# EAGLE design rrcmd (EAGLE 6.4)
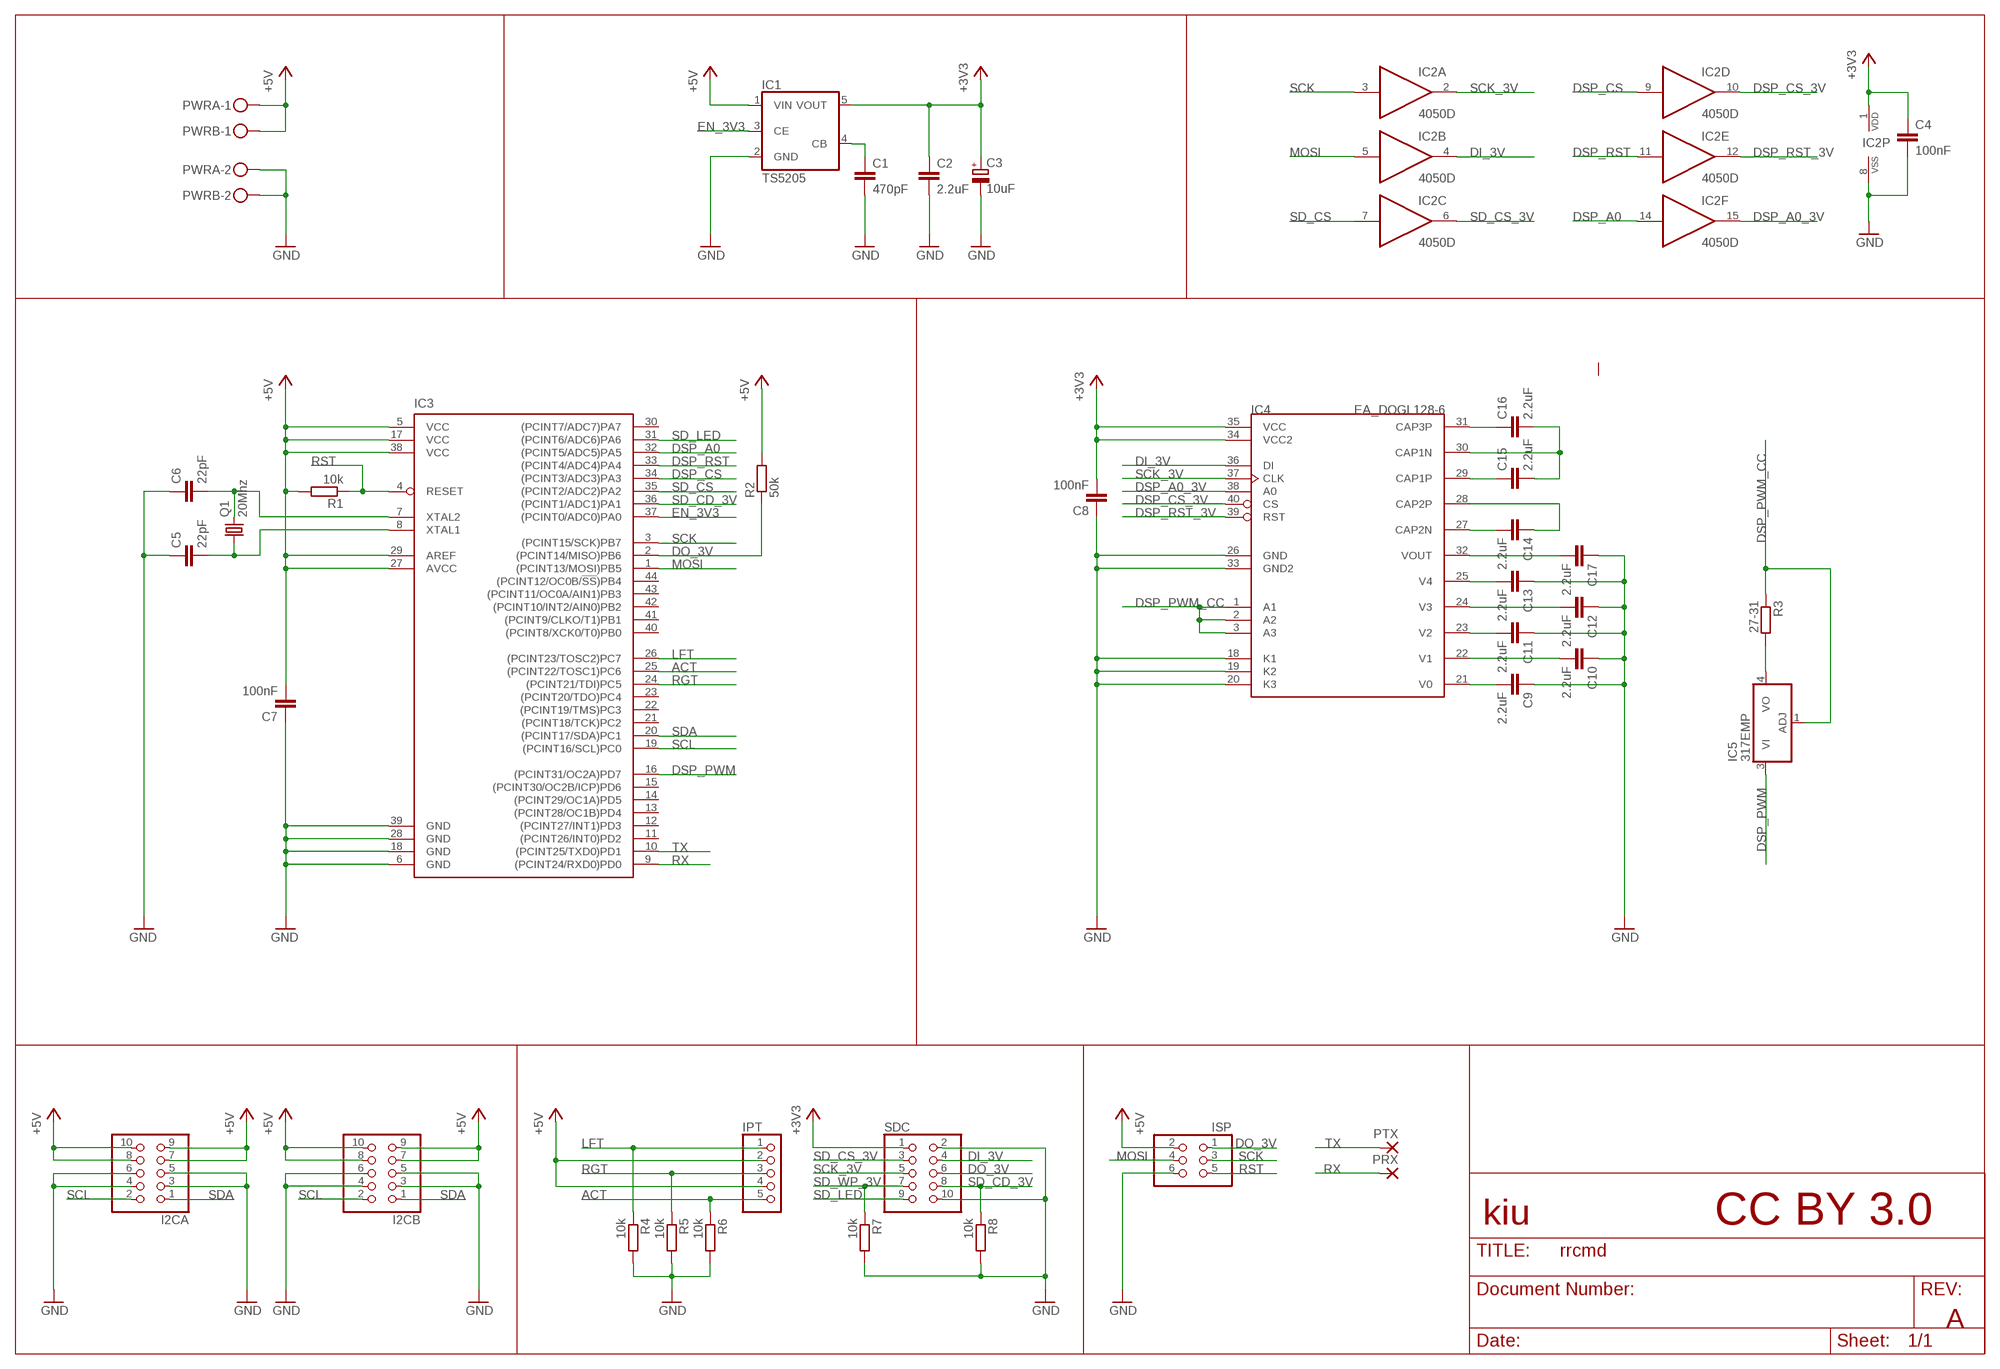
[diagram p0: schematic, sheet 1]

## Parts
C1  470pF  C-EUC0805  [C0805]
C2  2.2uF  C-EUC0805  [C0805]
C3  10uF  CPOL-EUCT3216  [CT3216]
C4  100nF  C-EUC0805  [C0805]
C5  22pF  C-EUC0805  [C0805]
C6  22pF  C-EUC0805  [C0805]
C7  100nF  C-EUC0805  [C0805]
C8  100nF  C-EUC0805  [C0805]
C9  2.2uF  C-EUC0805  [C0805]
C10  2.2uF  C-EUC0805  [C0805]
C11  2.2uF  C-EUC0805  [C0805]
C12  2.2uF  C-EUC0805  [C0805]
C13  2.2uF  C-EUC0805  [C0805]
C14  2.2uF  C-EUC0805  [C0805]
C15  2.2uF  C-EUC0805  [C0805]
C16  2.2uF  C-EUC0805  [C0805]
C17  2.2uF  C-EUC0805  [C0805]
I2CA  PINHD-2X5  [2X05]
I2CB  PINHD-2X5  [2X05]
IC1  TS5205  [SOT25]
IC2  4050D  [SO16]
IC3  ATMEGA644A  [TQFP44]
IC4  EA_DOGL128-6  [EA_DOGL128-6]
IC5  317EMP  [SOT223]
IPT  PINHD-1X5  [1X05]
ISP  PINHD-2X3  [2X03]
PRX  SMD2  [SMD1,27-2,54]
PTX  SMD2  [SMD1,27-2,54]
PWRA  MKDSN1,5/2-5,08  [MKDSN1,5/2-5,08]
PWRB  MKDSN1,5/2-5,08  [MKDSN1,5/2-5,08]
Q1  20Mhz  CRYSTALHC49UP  [HC49UP]
R1  10k  R-EU_R0805  [R0805]
R2  50k  R-EU_R0805  [R0805]
R3  27-31  R-EU_R0805  [R0805]
R4  10k  R-EU_R0805  [R0805]
R5  10k  R-EU_R0805  [R0805]
R6  10k  R-EU_R0805  [R0805]
R7  10k  R-EU_R0805  [R0805]
R8  10k  R-EU_R0805  [R0805]
SDC  PINHD-2X5  [2X05]

## Nets
+3V3: C2.1 C3.+ C4.1 C8.2 IC1.5(VOUT) IC2.1(P:VDD) IC4.34(VCC2) IC4.35(VCC) SDC.1
+5V: C7.2 I2CA.7 I2CA.8 I2CA.9 I2CA.10 I2CB.7 I2CB.8 I2CB.9 I2CB.10 IC1.1(VIN) IC3.5(VCC) IC3.17(VCC) IC3.27(AVCC) IC3.29(AREF) IC3.38(VCC) IPT.2 IPT.4 ISP.2 PWRA.1 PWRB.1 R1.2 R2.2
ACT: IC3.25((PCINT22/TOSC1)PC6) IPT.5 R6.1
CAP1N: C15.2 C16.2 IC4.30(CAP1N)
CAP1P: C15.1 IC4.29(CAP1P)
CAP2N: C14.2 IC4.27(CAP2N)
CAP2P: C14.1 IC4.28(CAP2P)
CAP3P: C16.1 IC4.31(CAP3P)
DI_3V: IC2.4(B:O) IC4.36(DI) SDC.4
DO_3V: IC3.2((PCINT14/MISO)PB6) ISP.1 R2.1 SDC.6
DSP_A0: IC2.14(F:I) IC3.32((PCINT5/ADC5)PA5)
DSP_A0_3V: IC2.15(F:O) IC4.38(A0)
DSP_CS: IC2.9(D:I) IC3.34((PCINT3/ADC3)PA3)
DSP_CS_3V: IC2.10(D:O) IC4.40(CS)
DSP_PWM: IC3.16((PCINT31/OC2A)PD7) IC5.3(VI)
DSP_PWM_CC: IC4.1(A1) IC4.2(A2) IC4.3(A3) IC5.1(ADJ) R3.1
DSP_RST: IC2.11(E:I) IC3.33((PCINT4/ADC4)PA4)
DSP_RST_3V: IC2.12(E:O) IC4.39(RST)
EN_3V3: IC1.3(CE) IC3.37((PCINT0/ADC0)PA0)
GND: C1.2 C2.2 C3.- C4.2 C5.1 C6.1 C7.1 C8.1 C9.1 C10.1 C11.1 C12.1 C13.1 C17.1 I2CA.3 I2CA.4 I2CA.5 I2CA.6 I2CB.3 I2CB.4 I2CB.5 I2CB.6 IC1.2(GND) IC2.8(P:VSS) IC3.6(GND) IC3.18(GND) IC3.28(GND) IC3.39(GND) IC4.18(K1) IC4.19(K2) IC4.20(K3) IC4.26(GND) IC4.33(GND2) ISP.6 PWRA.2 PWRB.2 R4.2 R5.2 R6.2 R7.2 R8.2 SDC.2 SDC.10
LFT: IC3.26((PCINT23/TOSC2)PC7) IPT.1 R4.1
MOSI: IC2.5(B:I) IC3.1((PCINT13/MOSI)PB5) ISP.4
N$1: C1.1 IC1.4(CB)
N$2: C12.2 IC4.24(V3)
N$3: C13.2 IC4.25(V4)
N$6: C11.2 IC4.23(V2)
N$7: C10.2 IC4.22(V1)
N$8: C9.2 IC4.21(V0)
N$9: C17.2 IC4.32(VOUT)
N$10: IC5.4(VO) R3.2
N$11: C6.2 IC3.7(XTAL2) Q1.2
N$12: C5.2 IC3.8(XTAL1) Q1.1
RGT: IC3.24((PCINT21/TDI)PC5) IPT.3 R5.1
RST: IC3.4(RESET) ISP.5 R1.1
RX: IC3.9((PCINT24/RXD0)PD0) PRX.1(P)
SCK: IC2.3(A:I) IC3.3((PCINT15/SCK)PB7) ISP.3
SCK_3V: IC2.2(A:O) IC4.37(CLK) SDC.5
SCL: I2CA.2 I2CB.2 IC3.19((PCINT16/SCL)PC0)
SD_CD_3V: IC3.36((PCINT1/ADC1)PA1) R8.1 SDC.8
SD_CS: IC2.7(C:I) IC3.35((PCINT2/ADC2)PA2)
SD_CS_3V: IC2.6(C:O) SDC.3
SD_LED: IC3.31((PCINT6/ADC6)PA6) SDC.9
SD_WP_3V: R7.1 SDC.7
SDA: I2CA.1 I2CB.1 IC3.20((PCINT17/SDA)PC1)
TX: IC3.10((PCINT25/TXD0)PD1) PTX.1(P)
Unconnected: IC3.11((PCINT26/INT0)PD2) IC3.12((PCINT27/INT1)PD3) IC3.13((PCINT28/OC1B)PD4) IC3.14((PCINT29/OC1A)PD5) IC3.15((PCINT30/OC2B/ICP)PD6) IC3.21((PCINT18/TCK)PC2) IC3.22((PCINT19/TMS)PC3) IC3.23((PCINT20/TDO)PC4) IC3.30((PCINT7/ADC7)PA7) IC3.40((PCINT8/XCK0/T0)PB0) IC3.41((PCINT9/CLKO/T1)PB1) IC3.42((PCINT10/INT2/AIN0)PB2) IC3.43((PCINT11/OC0A/AIN1)PB3) IC3.44((PCINT12/OC0B/!SS!)PB4)

## Notes on the sheet
- kiu | CC BY 3.0
- A

## Library data of the parts
C1 C2 C4-C17 = rcl:C-EU: CAPACITOR, European symbol
C3 = rcl:CPOL-EU: POLARIZED CAPACITOR, European symbol
I2CA I2CB SDC = pinhead:PINHD-2X5: PIN HEADER
IC1 = v-reg:TS5205: 150mA Low Noise LDO Voltage Regulator with Enable TSC [Taiwan Semiconductor Company, Ltd] Source: http://www.taiwansemi.com .. 5205_0409c.pdf
IC2 = 40xx:4050: Hex non-inverting BUFFER
IC3 = atmel:ATMEGA644: 8-bit Microcontroller with 64K Bytes In-System Programmable Flash Source: http://www.atmel.com/dyn/resources/prod_documents/doc2593.pdf; MPN: ATMEGA644PV-10AU; OC_FARNELL: 1455123; OC_NEWARK: 58M3748
IC4 = kiu:EA_DOGL128-6
IC5 = linear:*317: Positive VOLTAGE REGULATOR
IPT = pinhead:PINHD-1X5: PIN HEADER
ISP = pinhead:PINHD-2X3: PIN HEADER
PRX PTX = wirepad:SMD2: SMD PAD
PWRA PWRB = con-phoenix-508:MKDSN1,5/2-5,08: MKDSN 1,5/ 2-5,08 Printklemme Nennstrom: 13,5 A Nennspannung: 250 V Rastermaß: 5,08 mm Polzahl: 2 Anschlussart: Schraubanschluss Montage: Löten Anschlussrichtung Leiter/Platine: 0 ° Artikelnummer: 1729128 Source: http://eshop.phoenixcontact.com .. 1729128.pdf; MPN: MKDSN 1,5/2-5.08; OC_FARNELL: 1792903; OC_NEWARK: 30M2397
Q1 = crystal:CRYSTAL: CRYSTAL; OC_FARNELL: unknown; OC_NEWARK: unknown
R1-R8 = rcl:R-EU_: RESISTOR, European symbol

## Board
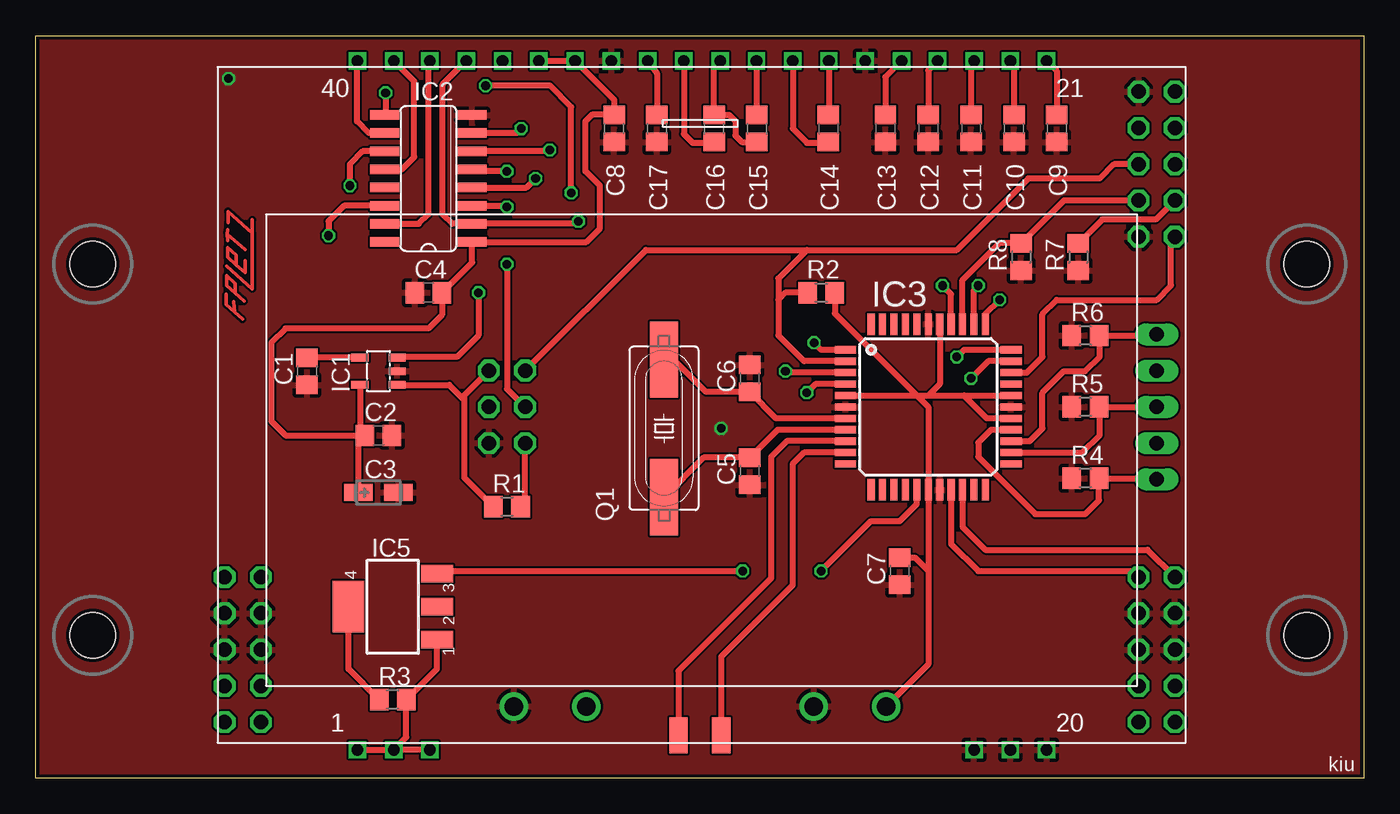
[diagram p1: board, top side]
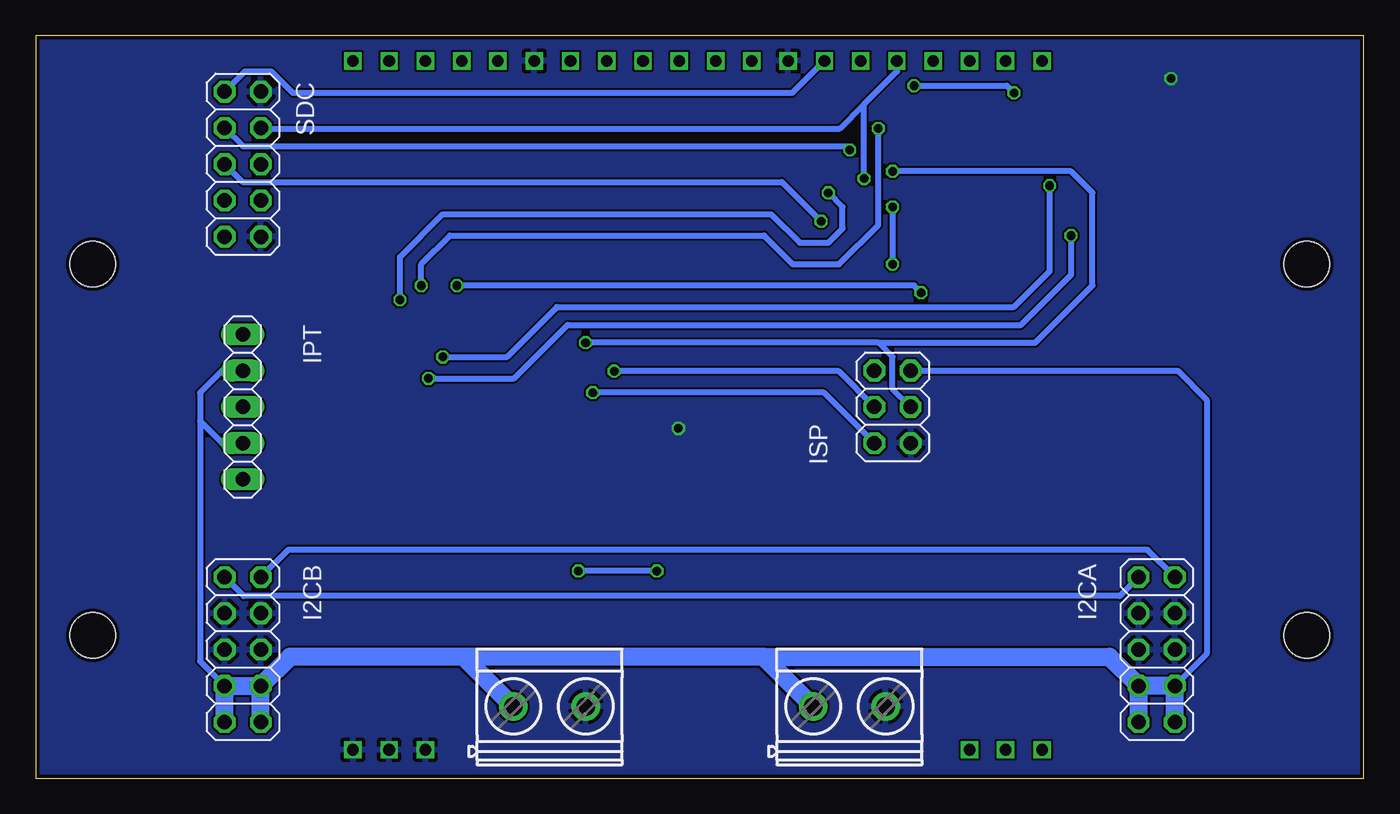
[diagram p2: board, bottom side, seen from below]

Size 93 x 52 mm. Coordinates in mm from the lower left corner, seen from the top.
Outline: 0,0 0,52 93,52 93,0 0,0
Copper layers (1*2*15*16): Top 0.035mm / dielectric 0.2mm / layer 2 0.0175mm / dielectric 1.1mm / layer 15 0.0175mm / dielectric 0.2mm / Bottom 0.035mm
Design rules "SeeedStudio_DRU_no_angle_20130527": minimum track width 6mil, minimum drill 12mil, track to track 6mil, track to pad 6mil, pad to pad 6mil, via to via 6mil, smd to smd 0mil, copper to edge 10mil, drill to drill 10mil, minimum pad ring 6mil, minimum via ring 6mil, stop-mask expansion 2mil, vias tented up to drill 25mil, thermal gap 10mil
Holes 3.2 mm at 4,36 89,36 89,10 4,10

### Footprints (pad centres in the part's own frame; a part is rotated, then mirrored left to right if it is on the bottom)
C0805 = smd 1.3 x 1.5: 1 -0.95,0; 2 0.95,0
CT3216 = smd 2 x 1.2: + -1.4,0; - 1.4,0
2X05 = drill 1.016 octagon: 1 -5.08,-1.27; 2 -5.08,1.27; 3 -2.54,-1.27; 4 -2.54,1.27; 5 0,-1.27; 6 0,1.27; 7 2.54,-1.27; 8 2.54,1.27; 9 5.08,-1.27; 10 5.08,1.27
SOT25 = smd 0.55 x 1.2: 1 -0.95,-1.3; 2 0,-1.3; 3 0.95,-1.3; 4 0.95,1.3; 5 -0.95,1.3
SO16 = smd 0.66 x 2.032: 1 -4.445,-3.073; 2 -3.175,-3.073; 3 -1.905,-3.073; 4 -0.635,-3.073; 5 0.635,-3.073; 6 1.905,-3.073; 7 3.175,-3.073; 8 4.445,-3.073; 9 4.445,3.073; 10 3.175,3.073; 11 1.905,3.073; 12 0.635,3.073; 13 -0.635,3.073; 14 -1.905,3.073; 15 -3.175,3.073; 16 -4.445,3.073
TQFP44 = smd 1.5 x 0.5: 1 -5.8,4; 2 -5.8,3.2; 3 -5.8,2.4; 4 -5.8,1.6; 5 -5.8,0.8; 6 -5.8,0; 7 -5.8,-0.8; 8 -5.8,-1.6; 9 -5.8,-2.4; 10 -5.8,-3.2; 11 -5.8,-4; 23 5.8,-4; 24 5.8,-3.2; 25 5.8,-2.4; 26 5.8,-1.6; 27 5.8,-0.8; 28 5.8,0; 29 5.8,0.8; 30 5.8,1.6; 31 5.8,2.4; 32 5.8,3.2; 33 5.8,4 | smd 0.5 x 1.5: 12 -4,-5.8; 13 -3.2,-5.8; 14 -2.4,-5.8; 15 -1.6,-5.8; 16 -0.8,-5.8; 17 0,-5.8; 18 0.8,-5.8; 19 1.6,-5.8; 20 2.4,-5.8; 21 3.2,-5.8; 22 4,-5.8; 34 4,5.8; 35 3.2,5.8; 36 2.4,5.8; 37 1.6,5.8; 38 0.8,5.8; 39 0,5.8; 40 -0.8,5.8; 41 -1.6,5.8; 42 -2.4,5.8; 43 -3.2,5.8; 44 -4,5.8
EA_DOGL128-6 = drill 0.813 square: 1 -23.97,-24.02; 2 -21.43,-24.02; 3 -18.89,-24.02; 18 19.21,-24.02; 19 21.75,-24.02; 20 24.29,-24.02; 21 24.29,24.24; 22 21.75,24.24; 23 19.21,24.24; 24 16.67,24.24; 25 14.13,24.24; 26 11.59,24.24; 27 9.05,24.24; 28 6.51,24.24; 29 3.97,24.24; 30 1.43,24.24; 31 -1.11,24.24; 32 -3.65,24.24; 33 -6.19,24.24; 34 -8.73,24.24; 35 -11.27,24.24; 36 -13.81,24.24; 37 -16.35,24.24; 38 -18.89,24.24; 39 -21.43,24.24; 40 -23.97,24.24
SOT223 = smd 1.219 x 2.235: 1 -2.311,-3.099; 2 0,-3.099; 3 2.311,-3.099 | smd 3.6 x 2.2: 4 0,3.099
1X05 = drill 1.016 long: 1 -5.08,0; 2 -2.54,0; 3 0,0; 4 2.54,0; 5 5.08,0
2X03 = drill 1.016 octagon: 1 -2.54,-1.27; 2 -2.54,1.27; 3 0,-1.27; 4 0,1.27; 5 2.54,-1.27; 6 2.54,1.27
SMD1,27-2,54 = smd 1.27 x 2.54: 1 0,0
MKDSN1,5/2-5,08 = drill 1.3 pad 2: 1 -2.561,0.025; 2 2.519,0.025
HC49UP = smd 5.334 x 1.93: 1 -4.826,0; 2 4.826,0
R0805 = smd 1.3 x 1.5: 1 -0.95,0; 2 0.95,0

### Placement (x,y rotation side)
C1  19,28.5 270 top
C2  24,24 0 top
C3  24,20 0 top
C4  27.5,34 180 top
C5  50,21.5 90 top
C6  50,28 270 top
C7  60.5,14.5 90 top
C8  40.5,45.5 90 top
C9  71.5,45.5 90 top
C10  68.5,45.5 90 top
C11  65.5,45.5 90 top
C12  62.5,45.5 90 top
C13  59.5,45.5 90 top
C14  55.5,45.5 90 top
C15  50.5,45.5 270 top
C16  47.5,45.5 90 top
C17  43.5,45.5 90 top
I2CA  14.5,9 270 bottom
I2CB  78.5,9 270 bottom
IC1  24,28.5 90 top
IC2  27.5,42 90 top
IC3  62.5,26 0 top
IC4  46.5,26 0 top
IC5  25,12 90 top
IPT  78.5,26 90 bottom
ISP  33,26 270 bottom
PRX  45,3 0 top
PTX  48,3 0 top
PWRA  36,5 0 bottom
PWRB  57,5 0 bottom
Q1  44,24.5 90 top
R1  33,19 180 top
R2  55,34 0 top
R3  25,5.5 180 top
R4  73.5,21 180 top
R5  73.5,26 180 top
R6  73.5,31 180 top
R7  73,36.5 270 top
R8  69,36.5 270 top
SDC  78.5,43 270 bottom

### Tracks (layer width: path | path; a pad name or v marks a point on that pad's centre or on a via)
+3V3
  Top 0.406: IC1.5 22.7,24.35 C2.1 | C3.+ 22.6,23.55 C2.1 | IC4.35 IC4.34 40.5,47.51 C8.2 40.45,46.5 39,46.5 38.5,46 38.5,42.5 39.5,41.5 39.5,38.5 38.55,37.55 IC2.1 30.57,36.12 C4.1 28.45,32.45 27.5,31.5 17.5,31.5 16.5,30.5 16.5,25 17.5,24 C2.1
  Bottom 0.406: SDC.1 78.35,49.5 76.5,49.5 75,48 40.01,48 IC4.34
+5V
  Top 0.406: ISP.2 30,26.81 30,26.5 | 30,26.5 30,21.05 R1.2 | IC3.5 61.7,26.8 | 61.7,26.8 62.5,26.8 | 62.5,26.8 65,26.8 | 65,26.8 IC3.29 | 62.5,14.5 IC3.17 62.5,26 61.7,26.8 | 62.5,14.5 62.5,7.96 PWRB.1 | IC3.38 63.3,27.6 62.5,26.8 | C7.2 61.55,15.45 62.5,14.5 | IC1.1 28.95,27.55 30,26.5 | IC3.27 66.6,25.2 65,26.8 | R2.2 55.95,32.55 61.7,26.8
  Bottom 0.406: ISP.2 13.04,28.54 11,26.5 11,8.69 I2CA.8 | IPT.4 79.96,28.54 81.5,27 81.5,25 | 81.5,25 81.5,8.19 I2CB.7 | IPT.2 79.96,23.46 81.5,25
  Bottom 1.27: I2CA.10 I2CA.8 I2CA.7 | I2CA.9 I2CA.7 | I2CB.10 I2CB.8 | I2CB.9 I2CB.7 | I2CB.7 I2CB.8 | PWRA.1 42.04,8.5 | 42.04,8.5 63.04,8.5 | 63.04,8.5 75.19,8.5 I2CB.8 | 42.04,8.5 17.81,8.5 I2CA.7 | PWRB.1 63.04,8.5 | 79.81,6.5 I2CB.7
ACT
  Top 0.406: IPT.5 78.42,31 R6.1 74.5,30.95 74.5,29.5 73.5,28.5 72,28.5 70.5,27 70.5,24.5 69.6,23.6 IC3.25
CAP1N
  Top 0.406: IC4.30 47.5,49.81 C16.2 48.55,46.45 49,46 49,45 49.45,44.55 C15.2
CAP1P
  Top 0.406: IC4.29 50.47,46.48 C15.1
CAP2N
  Top 0.406: IC4.27 55.55,46.5 C14.2
CAP2P
  Top 0.406: IC4.28 53.01,45.49 54,44.5 55.45,44.5 C14.1
CAP3P
  Top 0.406: IC4.31 45.39,45.11 46,44.5 47.45,44.5 C16.1
DI_3V  (via drill 0.6)
  Top 0.406: IC2.4 34.37,41.37 v35,42
  Bottom 0.406: SDC.4 77.19,45.5 36.69,45.5 35,47.19 | 35,47.19 32.69,49.5 IC4.36 | v35,42 35,47.19
DO_3V
  Top 0.406: ISP.1 42.73,37 54,37 | 54,37 64.5,37 69.5,42 74.5,42 75.5,43 SDC.6 | IC3.2 53.8,29.2 52,31 52,33.5 | 54,37 52,35 52,33.5 | R2.1 52.5,34 52,33.5
DSP_A0  (via drill 0.6)
  Top 0.406: IC3.32 66.7,29.2 v65.5,28 | IC2.14 21.59,40.09 20.5,39 v20.5,38
  Bottom 0.406: v65.5,28 59.5,28 55.75,31.75 24,31.75 20.5,35.25 v20.5,38
DSP_A0_3V
  Top 0.406: IC2.15 26.82,38.83 27.5,39.5 27.5,50.13 IC4.38
DSP_CS  (via drill 0.6)
  Top 0.406: IC3.34 66.5,32.5 v67.5,33.5 | v37.5,41 37.5,47 36,48.5 v31.5,48.5 | v24.5,48 24.5,46.52 IC2.9
  Bottom 0.406: v67.5,33.5 67.5,36.5 64.5,39.5 41.5,39.5 39.5,37.5 37.5,37.5 36.5,38.5 36.5,40 v37.5,41 | v31.5,48.5 25,48.5 v24.5,48
DSP_CS_3V
  Top 0.406: IC2.10 23.32,45.17 22.5,46 22.5,50.21 IC4.40
DSP_PWM  (via drill 0.6)
  Top 0.406: IC5.3 28.29,14.5 v49.5,14.5 | v55,14.5 58.5,18 60.5,18 61.7,19.2 IC3.16
  Bottom 0.406: v49.5,14.5 v55,14.5
DSP_PWM_CC
  Top 0.406: IC4.1 IC4.2 | IC4.2 25.95,2.86 R3.1 28.1,7.65 IC5.1 | IC4.3 IC4.2
DSP_RST  (via drill 0.6)
  Top 0.406: IC2.11 22.91,43.91 22,43 v22,41.5 | IC3.33 65,30 v64.5,29.5
  Bottom 0.406: v64.5,29.5 60,29.5 56.5,33 24.5,33 22,35.5 v22,41.5
DSP_RST_3V
  Top 0.406: IC2.12 25.64,42.63 26.5,43.5 26.5,48.81 IC4.39
EN_3V3  (via drill 0.6)
  Top 0.406: IC3.37 64.1,33.9 v63.5,34.5 | IC1.3 25.35,29.5 29.5,29.5 31,31 v31,34
  Bottom 0.406: v63.5,34.5 31.5,34.5 v31,34
GND  (via drill 0.6)
  Top 0.406: 59.45,44.5 C13.1
  other vias: 13.5,49 48,24.5
  pour Top: -0.5,52.5 93.5,52.5 93.5,-0.5 -0.5,-0.5
  pour Bottom: -0.5,52.5 93.5,52.5 93.5,-0.5 -0.5,-0.5
LFT
  Top 0.406: IPT.1 78.42,21 R4.1 74.45,19.45 73.5,18.5 70,18.5 66,22.5 66,23.5 66.9,24.4 IC3.26
MOSI  (via drill 0.6)
  Top 0.406: IC3.1 55,30 v54.5,30.5 | v33,42.5 30.71,42.5 IC2.5
  Bottom 0.406: ISP.4 33,27.27 33,29.5 34,30.5 | 34,30.5 v54.5,30.5 | 34,30.5 23,30.5 19,34.5 19,41 20.5,42.5 v33,42.5
N$1
  Top 0.406: IC1.4 C1.1
N$2
  Top 0.406: IC4.24 62.5,49.57 C12.2
N$3
  Top 0.406: IC4.25 59.5,49.11 C13.2
N$6
  Top 0.406: IC4.23 65.5,50.03 C11.2
N$7
  Top 0.406: IC4.22 68.5,49.99 C10.2
N$8
  Top 0.406: IC4.21 71.5,49.53 C9.2
N$9
  Top 0.406: IC4.32 43.5,49.39 C17.2
N$10
  Top 0.406: R3.2 21.9,7.65 IC5.4
N$11
  Top 0.406: IC3.7 51.85,25.2 C6.2 46.95,27.05 44.67,29.33 Q1.2
N$12
  Top 0.406: IC3.8 51.95,24.4 C5.2 46.78,22.45 Q1.1
N$28
  Top 0.254: 13.98,33.96 13.36,34.51 13.37,35.18 13.98,34.63 13.98,33.96 | 14.59,33.41 13.98,33.96
N$29
  Top 0.254: 13.37,35.86 15.18,34.25 15.17,38.17 | 13.47,38.92 13.47,39.69 15.17,38.17 | 15.17,38.17 15.16,39.11
N$30
  Top 0.254: 14.65,36.25 14.66,35.39 14.04,35.94 | 14.04,35.94 13.43,36.49 13.43,37.17 14.05,36.62 14.04,35.94
N$31
  Top 0.254: 13.35,33.9 13.35,33.16 13.92,32.65 | 13.92,32.65 14.49,32.15 | 13.92,32.65 13.88,33.37
N$32
  Top 0.254: 13.42,38.11 13.45,37.66 | 14.66,37.01 13.42,38.11 | 13.42,38.11 13.45,38.43
RGT
  Top 0.406: IC3.24 73.3,22.8 74.5,24 74.5,25.95 R5.1 IPT.3
RST  (via drill 0.6)
  Top 0.406: R1.1 34.27,19.32 ISP.5 | IC3.4 54.6,27.6 v54,27
  Bottom 0.406: ISP.5 37.81,27 v54,27
RX
  Top 0.406: IC3.9 52.6,23.6 51.5,22.5 51.5,14 45,7.5 PRX.1
SCK  (via drill 0.6)
  Top 0.406: IC3.3 52.6,28.4 v52.5,28.5 | IC2.3 32.91,40.09 v33,40 | v33,36 33,27.27 ISP.3
  Bottom 0.406: ISP.3 36.77,28.5 v52.5,28.5 | v33,40 v33,36
SCK_3V  (via drill 0.6)
  Top 0.406: v38,39 37.83,38.83 IC2.2 29.18,38.83 28.5,39.5 28.5,48.59 IC4.37
  Bottom 0.406: SDC.5 78.52,41.75 40.75,41.75 v38,39
SCL
  Top 0.406: IC3.19 64.1,16.4 66,14.5 76.81,14.5 I2CB.2
  Bottom 0.406: I2CA.2 15.15,16 75.31,16 I2CB.2
SD_CD_3V
  Top 0.406: SDC.8 72.01,40.46 R8.1 68.95,37.5 67.5,37.5 64.9,34.9 IC3.36
SD_CS  (via drill 0.6)
  Top 0.406: IC3.35 65.7,34.2 v66,34.5 | v34,45.5 33.67,45.17 IC2.7
  Bottom 0.406: v66,34.5 66,36 64,38 42,38 40,36 36.75,36 34,38.75 v34,45.5
SD_CS_3V  (via drill 0.6)
  Top 0.406: v36,44 35.91,43.91 IC2.6
  Bottom 0.406: SDC.3 78.48,44.25 36.25,44.25 v36,44
SD_LED
  Top 0.406: IC3.31 69.4,28.4 70.5,29.5 70.5,32.5 71.5,33.5 78.5,33.5 79.5,34.5 79.5,37.65 SDC.9
SD_WP_3V
  Top 0.406: SDC.7 78.44,39.12 74.67,39.12 R7.1
SDA
  Top 0.406: IC3.20 64.9,17.6 66.5,16 77.85,16 I2CB.1
  Bottom 0.406: I2CA.1 17.1,12.75 78.44,12.75 I2CB.1
TX
  Top 0.406: IC3.10 53.8,22.8 53,22 53,13.5 48,8.5 PTX.1

### Text on the board
tNames: kiu
tDocu: RRCMD REV A
bDocu: +5V | +5V